# Altium schematic sheet I2C UV Sensor.SchDoc: UV Sensor
size 292 x 193 mm; SheetNumber: 12; SheetTotal: 40
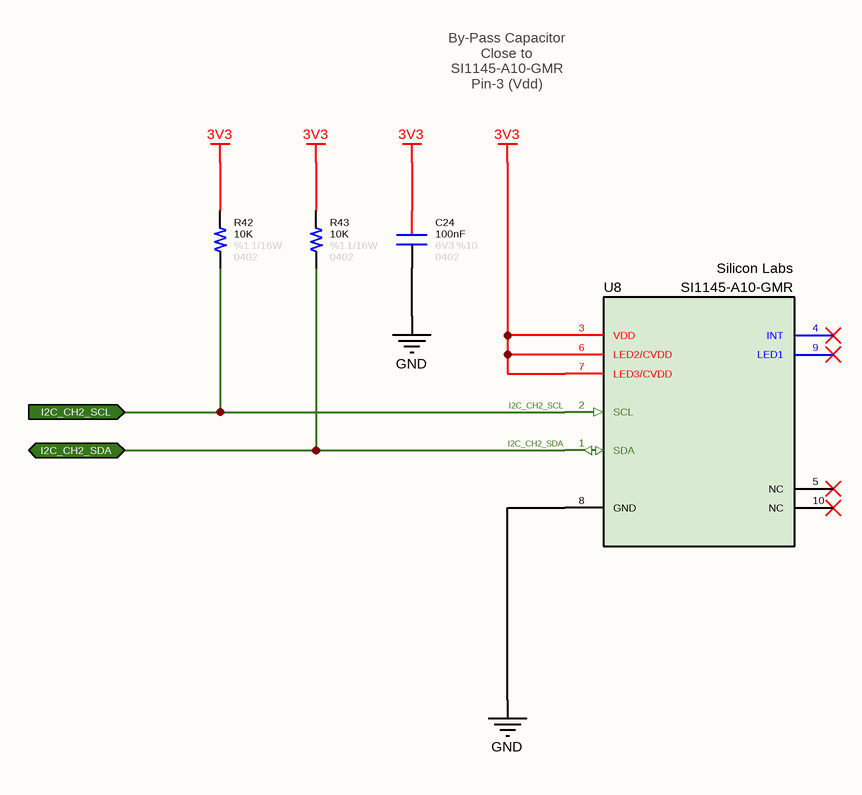
[diagram p0: I2C UV Sensor.SchDoc]

## Parts
C24  value 100nF  Tolerance: %10  Voltage: 6V3  Case: 0402  [CAPACITOR_0402]  (hidden comment: Capacitor - 100nF [0402] (Ceramic))
R42  value 10K  Tolerance: %1  Case: 0402  Power: 1/16W  [RESISTOR_0402]  (hidden comment: 10K - 0402 - %1 - 1/16W)
R43  value 10K  Tolerance: %1  Case: 0402  Power: 1/16W  [RESISTOR_0402]  (hidden comment: 10K - 0402 - %1 - 1/16W)
U8  Manufacturer Name: Silicon Labs  [SI1145]  (hidden comment: Si1145-A10-GMR)

## Ports
I2C_CH2_SCL (in), I2C_CH2_SDA (bidir)

## Nets
3V3: C24.2 R42.2 R43.2 U8.3(VDD) U8.6(LED2/CVDD) U8.7(LED3/CVDD)
GND: C24.1 U8.8(GND)
I2C_CH2_SCL: R42.1 U8.2(SCL) ; port I2C_CH2_SCL
I2C_CH2_SDA: R43.1 U8.1(SDA) ; port I2C_CH2_SDA

Not connected (* = marked no-connect by the designer): U8 4(INT)* 5(NC)* 9(LED1)* 10(NC)*

## Notes on the sheet
- By-Pass Capacitor
  Close to SI1145-A10-GMR
  Pin-3 (Vdd)
- © 2021 All rights reserved.
  This document may not, in whole or in part, be copied, photocopied, reproduced, translated or converted to any electronic or machine readable from without prior written permission of Mehmet Günce Akkoyun.
  Engineer contact : akkoyun@me.com
- Property of
- Engineer :
- Date :
- Size :
- A4
- Time :
- Project :
- Page :
- /
- Customer :
- Product ID :
- Module ID :
- Version :
- File :
- Revision :

## Library data of the parts
C24 = Capacitor - 100nF [0402-6V3]: Capacitor - 100nF [0402-6V3] (Ceramic); Manufacturer Name: AVX; Manufacturer Part Number: 04026D104KAT4A; ComponentLink1Description: Mouser; ComponentLink1URL: https://www.mouser.com.tr/ProductDetail/AVX/04026D104KAT4A?qs=sGAEpiMZZMs0AnBnWHyRQPg4iYkCw7IMED%2F4kpqgf7w%3D; ComponentLink2Description: DataSheet; ComponentLink2URL: https://www.mouser.com.tr/datasheet/2/40/cx5r-776519.pdf
R42 R43 = Resistor - 10K [0402]: Thick Film Resistors - SMD 1/16 W 10 KOhm 1%; Manufacturer Name: Vishay; Manufacturer Part Number: CRCW040210K0FKED; ComponentLink1Description: DataSheet; ComponentLink1URL: https://www.mouser.com.tr/datasheet/2/427/dcrcwe3-1762152.pdf; ComponentLink2Description: Mouser; ComponentLink2URL: https://www.mouser.com.tr/ProductDetail/Vishay-Dale/CRCW040210K0FKED?qs=sGAEpiMZZMu61qfTUdNhG2DpbjADlD3GcalbOv9utCY%3D
U8 = IC - Si1145-A10-GMR: Proximity Sensors I2C UV Index and Proximity/Ambient Light Sensor with 1 LED Driver; Case: QFN-10; RoHS: Yes; Manufacturer Part Number: SI1145-A10-GMR